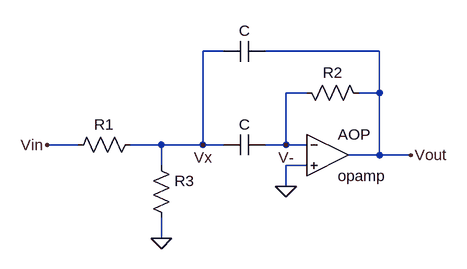
[diagram p0: schematic schematic.asc]
schematic.asc, the LTspice schematic file:
Version 4
SHEET 1 880 680
WIRE 160 -64 128 -64
WIRE 400 -64 224 -64
WIRE 288 0 256 0
WIRE 400 0 400 -64
WIRE 400 0 368 0
WIRE -64 80 -112 80
WIRE 64 80 16 80
WIRE 128 80 128 -64
WIRE 128 80 64 80
WIRE 160 80 128 80
WIRE 256 80 256 0
WIRE 256 80 224 80
WIRE 288 80 256 80
WIRE 400 96 400 0
WIRE 400 96 352 96
WIRE 448 96 400 96
WIRE 64 112 64 80
WIRE 288 112 256 112
WIRE 256 144 256 112
WIRE 64 224 64 192
FLAG -112 80 Vin
FLAG 64 224 0
FLAG 128 80 Vx
FLAG 256 80 V-
FLAG 256 144 0
FLAG 448 96 Vout
SYMBOL res 32 64 R90
WINDOW 0 0 56 VBottom 2
WINDOW 3 32 56 VTop 2
SYMATTR InstName R1
SYMATTR Value ""
SYMBOL res 384 16 M270
WINDOW 0 32 56 VTop 2
WINDOW 3 0 56 VBottom 2
SYMATTR InstName R2
SYMATTR Value ""
SYMBOL cap 224 96 M270
WINDOW 0 32 32 VTop 2
WINDOW 3 0 32 VBottom 2
SYMATTR InstName C
SYMATTR Value ""
SYMBOL cap 160 -80 M90
WINDOW 0 0 32 VBottom 2
WINDOW 3 32 32 VTop 2
SYMATTR InstName C
SYMATTR Value ""
SYMBOL res 48 96 R0
SYMATTR InstName R3
SYMATTR Value ""
SYMBOL OpAmps\\opamp 320 32 R0
SYMATTR InstName AOP

The netlist it stands for:
* schematic.asc
R1 Vx Vin
R2 Vout V-
C V- Vx
C Vx Vout
R3 Vx 0
XAOP V- 0 Vout opamp Aol=100K GBW=10Meg  ; pins invin noninvin out
.backanno
.end